# EAGLE schematic Servo_driver (EAGLE 9.6.2)
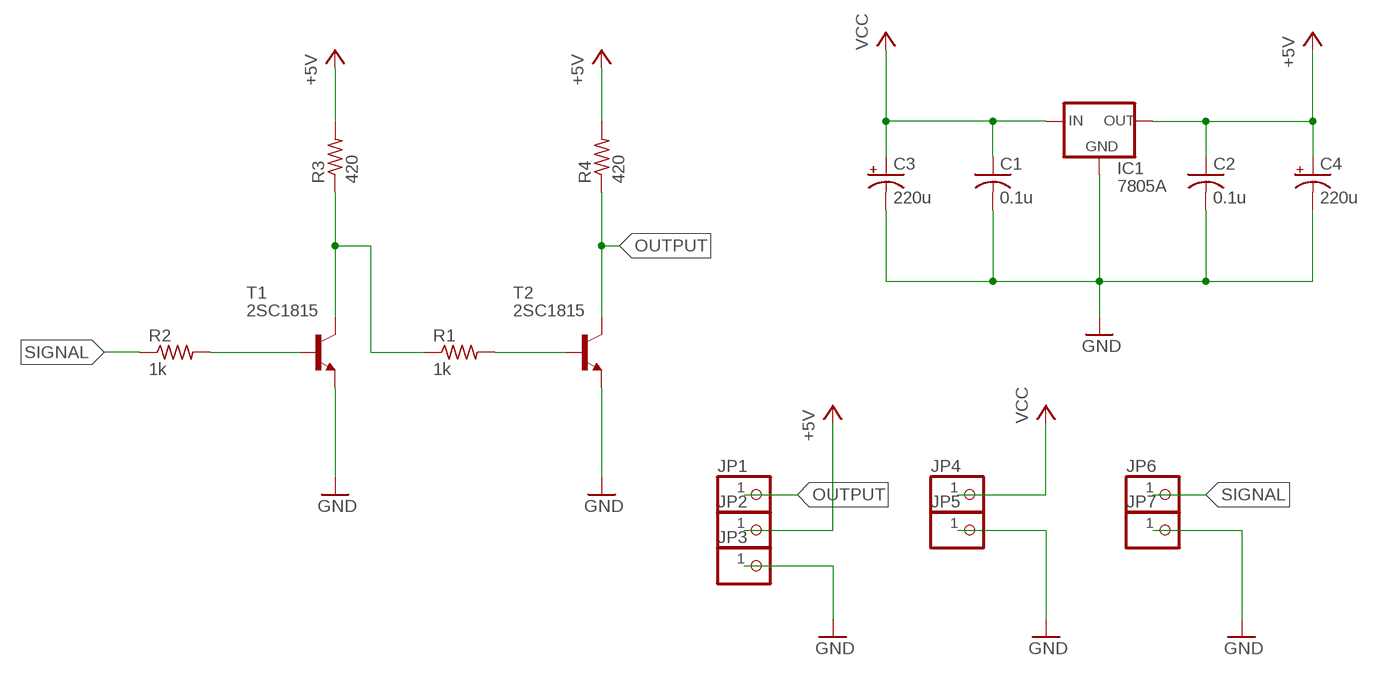
[diagram p0: schematic, sheet 1]

## Parts
C1  0.1u  C-US050-024X044  [C050-024X044]
C2  0.1u  C-US050-024X044  [C050-024X044]
C3  220u  CPOL-USE2.5-6  [E2,5-6]
C4  220u  CPOL-USE2.5-6  [E2,5-6]
IC1  7805A  78XXS  [78XXS]
JP1  PINHD-1X1  [1X01]
JP2  PINHD-1X1  [1X01]
JP3  PINHD-1X1  [1X01]
JP4  PINHD-1X1  [1X01]
JP5  PINHD-1X1  [1X01]
JP6  PINHD-1X1  [1X01]
JP7  PINHD-1X1  [1X01]
R1  1k  R-US_0204/7  [0204/7]
R2  1k  R-US_0204/7  [0204/7]
R3  420  R-US_0204/7  [0204/7]
R4  420  R-US_0204/7  [0204/7]
T1  2SC1815  [TO92-ECB]
T2  2SC1815  [TO92-ECB]

## Nets
+5V: C2.1 C4.+ IC1.OUT JP2.1 R3.2 R4.2
GND: C1.2 C2.2 C3.- C4.- IC1.GND JP3.1 JP5.1 JP7.1 T1.E T2.E
N$1: R2.2 T1.B
N$2: R1.1 R3.1 T1.C
N$3: R1.2 T2.B
OUTPUT: JP1.1 R4.1 T2.C
SIGNAL: JP6.1 R2.1
VCC: C1.1 C3.+ IC1.IN JP4.1

## Library data of the parts
C1 C2 = rcl:C-US: CAPACITOR, American symbol; SPICEPREFIX: C
C3 C4 = rcl:CPOL-US: POLARIZED CAPACITOR, American symbol; SPICEPREFIX: C
IC1 = v-reg:78XXS: VOLTAGE REGULATOR
JP1-JP7 = pinhead:PINHD-1X1: PIN HEADER
R1-R4 = rcl:R-US_: RESISTOR, American symbol; SPICEPREFIX: R
T1 T2 = transistor:2SC1815: NPN EPITAXIAL TRANSISTOR Source: TOSHIBA .. 2SC1815 1.pdf